# EAGLE schematic ram-8x2K (EAGLE 9.1.3)
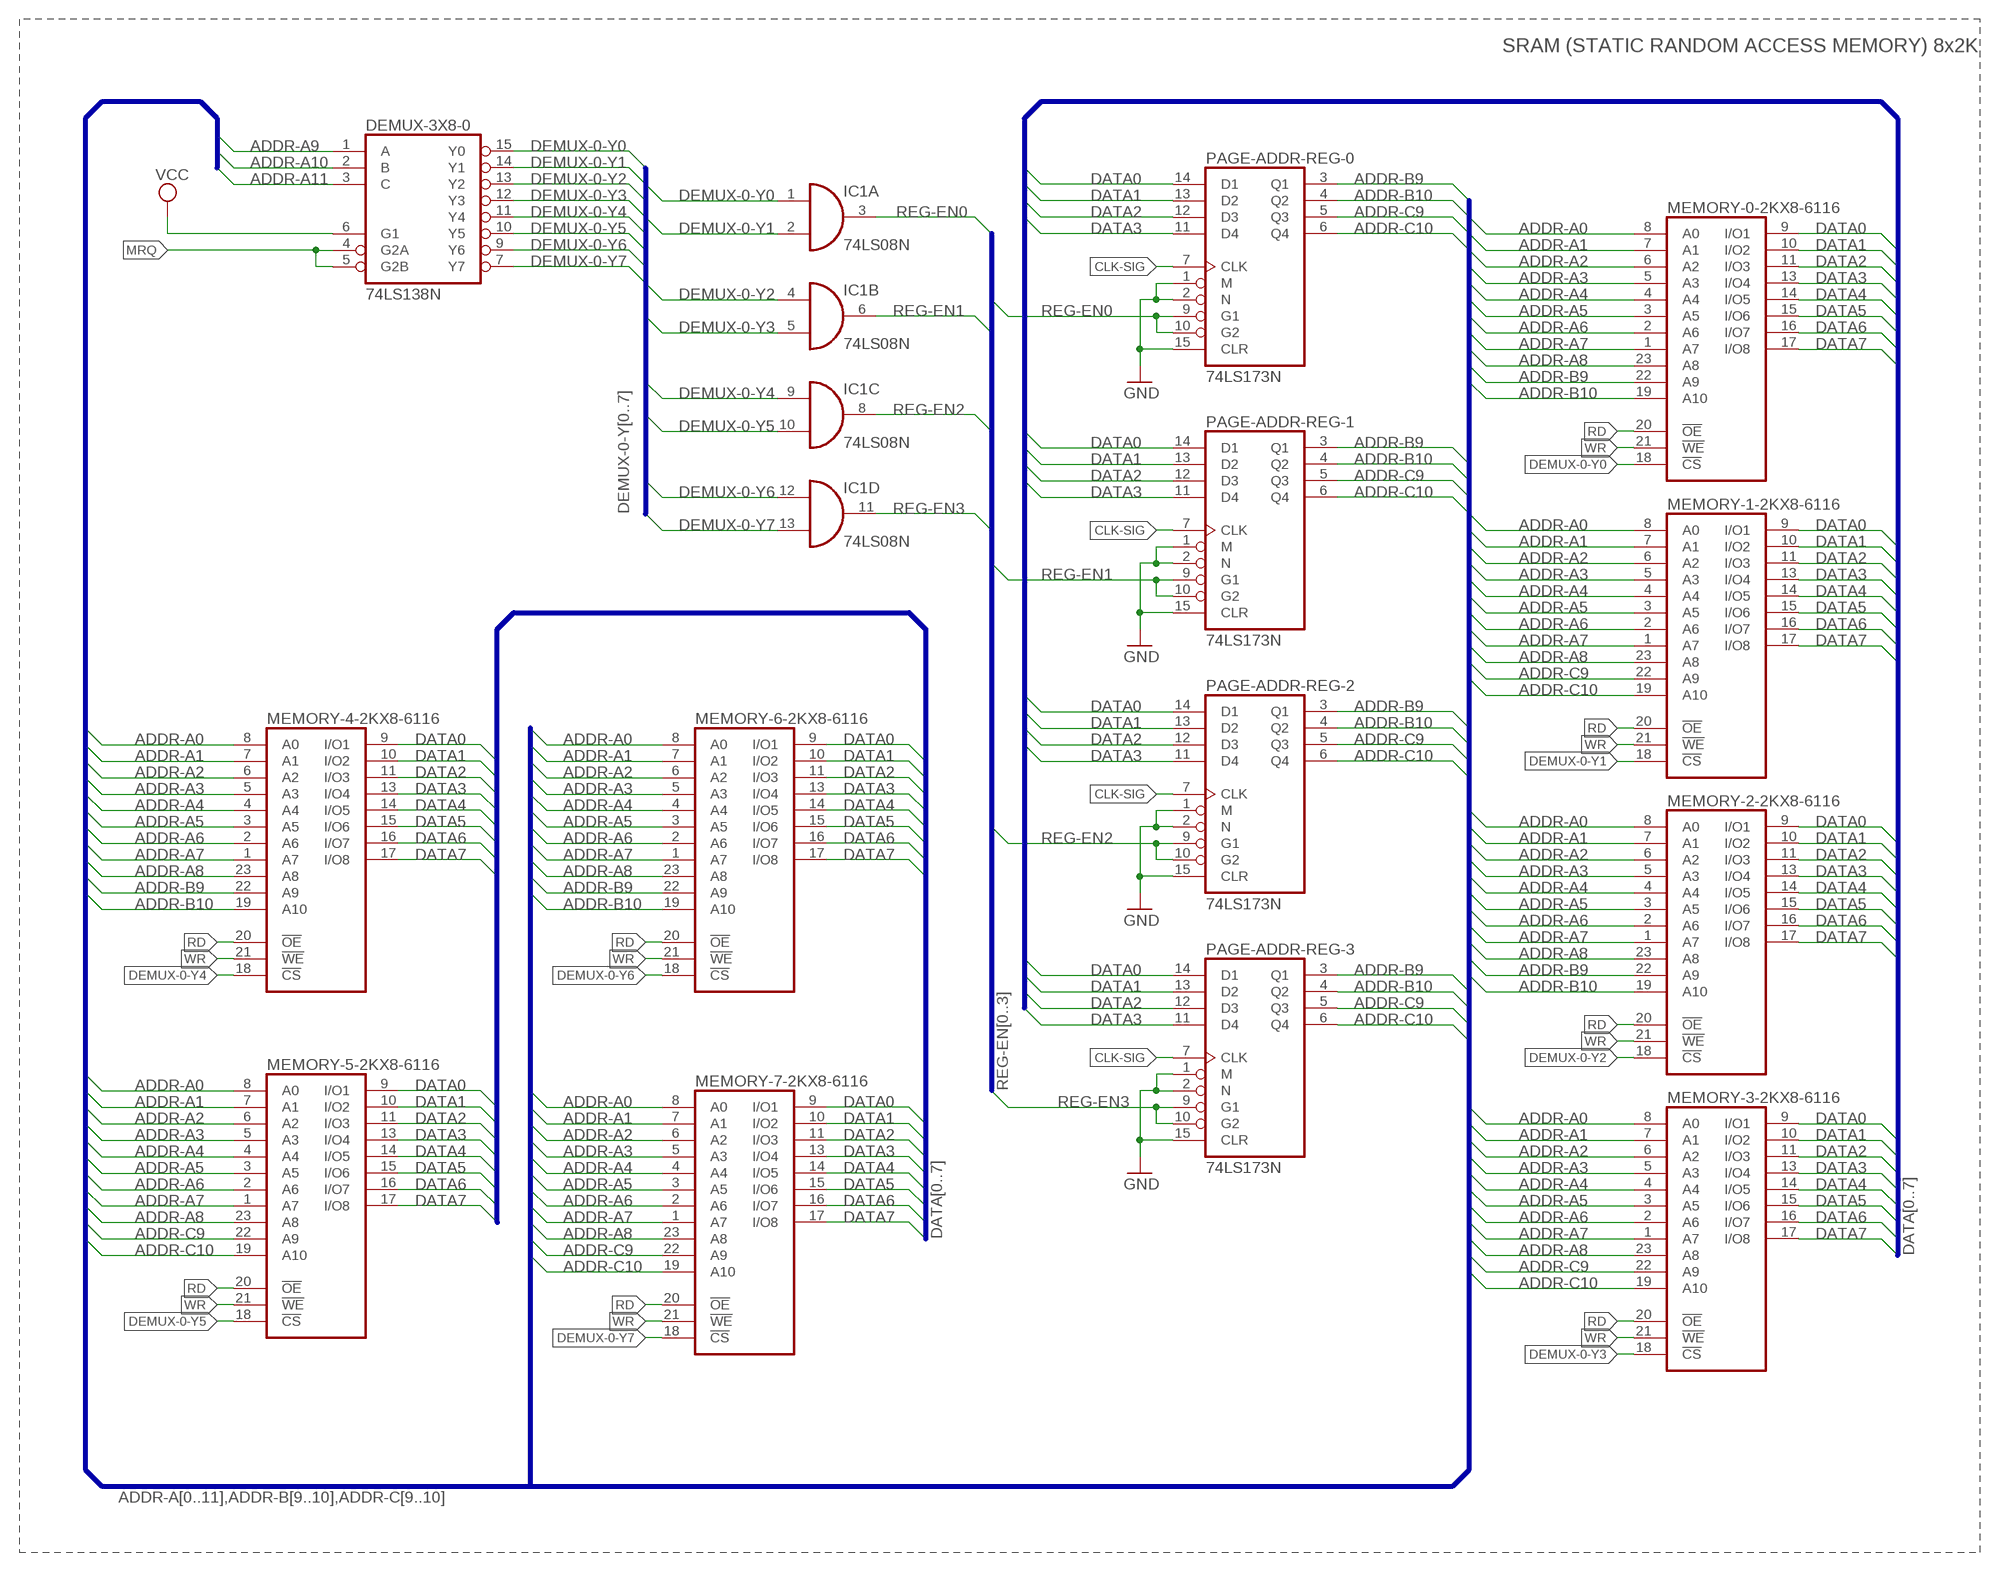
[diagram p0: schematic, sheet 1]

## Parts
DEMUX-3X8-0  74LS138N  [DIL16]
IC1  74LS08N  [DIL14]
MEMORY-0-2KX8-6116  6116P  [DIL24-6]
MEMORY-1-2KX8-6116  6116P  [DIL24-6]
MEMORY-2-2KX8-6116  6116P  [DIL24-6]
MEMORY-3-2KX8-6116  6116P  [DIL24-6]
MEMORY-4-2KX8-6116  6116P  [DIL24-6]
MEMORY-5-2KX8-6116  6116P  [DIL24-6]
MEMORY-6-2KX8-6116  6116P  [DIL24-6]
MEMORY-7-2KX8-6116  6116P  [DIL24-6]
PAGE-ADDR-REG-0  74LS173N  [DIL16]
PAGE-ADDR-REG-1  74LS173N  [DIL16]
PAGE-ADDR-REG-2  74LS173N  [DIL16]
PAGE-ADDR-REG-3  74LS173N  [DIL16]

## Nets
ADDR-A0: MEMORY-0-2KX8-6116.8(A0) MEMORY-1-2KX8-6116.8(A0) MEMORY-2-2KX8-6116.8(A0) MEMORY-3-2KX8-6116.8(A0) MEMORY-4-2KX8-6116.8(A0) MEMORY-5-2KX8-6116.8(A0) MEMORY-6-2KX8-6116.8(A0) MEMORY-7-2KX8-6116.8(A0)
ADDR-A1: MEMORY-0-2KX8-6116.7(A1) MEMORY-1-2KX8-6116.7(A1) MEMORY-2-2KX8-6116.7(A1) MEMORY-3-2KX8-6116.7(A1) MEMORY-4-2KX8-6116.7(A1) MEMORY-5-2KX8-6116.7(A1) MEMORY-6-2KX8-6116.7(A1) MEMORY-7-2KX8-6116.7(A1)
ADDR-A2: MEMORY-0-2KX8-6116.6(A2) MEMORY-1-2KX8-6116.6(A2) MEMORY-2-2KX8-6116.6(A2) MEMORY-3-2KX8-6116.6(A2) MEMORY-4-2KX8-6116.6(A2) MEMORY-5-2KX8-6116.6(A2) MEMORY-6-2KX8-6116.6(A2) MEMORY-7-2KX8-6116.6(A2)
ADDR-A3: MEMORY-0-2KX8-6116.5(A3) MEMORY-1-2KX8-6116.5(A3) MEMORY-2-2KX8-6116.5(A3) MEMORY-3-2KX8-6116.5(A3) MEMORY-4-2KX8-6116.5(A3) MEMORY-5-2KX8-6116.5(A3) MEMORY-6-2KX8-6116.5(A3) MEMORY-7-2KX8-6116.5(A3)
ADDR-A4: MEMORY-0-2KX8-6116.4(A4) MEMORY-1-2KX8-6116.4(A4) MEMORY-2-2KX8-6116.4(A4) MEMORY-3-2KX8-6116.4(A4) MEMORY-4-2KX8-6116.4(A4) MEMORY-5-2KX8-6116.4(A4) MEMORY-6-2KX8-6116.4(A4) MEMORY-7-2KX8-6116.4(A4)
ADDR-A5: MEMORY-0-2KX8-6116.3(A5) MEMORY-1-2KX8-6116.3(A5) MEMORY-2-2KX8-6116.3(A5) MEMORY-3-2KX8-6116.3(A5) MEMORY-4-2KX8-6116.3(A5) MEMORY-5-2KX8-6116.3(A5) MEMORY-6-2KX8-6116.3(A5) MEMORY-7-2KX8-6116.3(A5)
ADDR-A6: MEMORY-0-2KX8-6116.2(A6) MEMORY-1-2KX8-6116.2(A6) MEMORY-2-2KX8-6116.2(A6) MEMORY-3-2KX8-6116.2(A6) MEMORY-4-2KX8-6116.2(A6) MEMORY-5-2KX8-6116.2(A6) MEMORY-6-2KX8-6116.2(A6) MEMORY-7-2KX8-6116.2(A6)
ADDR-A7: MEMORY-0-2KX8-6116.1(A7) MEMORY-1-2KX8-6116.1(A7) MEMORY-2-2KX8-6116.1(A7) MEMORY-3-2KX8-6116.1(A7) MEMORY-4-2KX8-6116.1(A7) MEMORY-5-2KX8-6116.1(A7) MEMORY-6-2KX8-6116.1(A7) MEMORY-7-2KX8-6116.1(A7)
ADDR-A8: MEMORY-0-2KX8-6116.23(A8) MEMORY-1-2KX8-6116.23(A8) MEMORY-2-2KX8-6116.23(A8) MEMORY-3-2KX8-6116.23(A8) MEMORY-4-2KX8-6116.23(A8) MEMORY-5-2KX8-6116.23(A8) MEMORY-6-2KX8-6116.23(A8) MEMORY-7-2KX8-6116.23(A8)
ADDR-A9: DEMUX-3X8-0.1(A)
ADDR-A10: DEMUX-3X8-0.2(B)
ADDR-A11: DEMUX-3X8-0.3(C)
ADDR-B9: MEMORY-0-2KX8-6116.22(A9) MEMORY-2-2KX8-6116.22(A9) MEMORY-4-2KX8-6116.22(A9) MEMORY-6-2KX8-6116.22(A9) PAGE-ADDR-REG-0.3(Q1) PAGE-ADDR-REG-1.3(Q1) PAGE-ADDR-REG-2.3(Q1) PAGE-ADDR-REG-3.3(Q1)
ADDR-B10: MEMORY-0-2KX8-6116.19(A10) MEMORY-2-2KX8-6116.19(A10) MEMORY-4-2KX8-6116.19(A10) MEMORY-6-2KX8-6116.19(A10) PAGE-ADDR-REG-0.4(Q2) PAGE-ADDR-REG-1.4(Q2) PAGE-ADDR-REG-2.4(Q2) PAGE-ADDR-REG-3.4(Q2)
ADDR-C9: MEMORY-1-2KX8-6116.22(A9) MEMORY-3-2KX8-6116.22(A9) MEMORY-5-2KX8-6116.22(A9) MEMORY-7-2KX8-6116.22(A9) PAGE-ADDR-REG-0.5(Q3) PAGE-ADDR-REG-1.5(Q3) PAGE-ADDR-REG-2.5(Q3) PAGE-ADDR-REG-3.5(Q3)
ADDR-C10: MEMORY-1-2KX8-6116.19(A10) MEMORY-3-2KX8-6116.19(A10) MEMORY-5-2KX8-6116.19(A10) MEMORY-7-2KX8-6116.19(A10) PAGE-ADDR-REG-0.6(Q4) PAGE-ADDR-REG-1.6(Q4) PAGE-ADDR-REG-2.6(Q4) PAGE-ADDR-REG-3.6(Q4)
CLK-SIG: PAGE-ADDR-REG-0.7(CLK) PAGE-ADDR-REG-1.7(CLK) PAGE-ADDR-REG-2.7(CLK) PAGE-ADDR-REG-3.7(CLK)
DATA0: MEMORY-0-2KX8-6116.9(I/O1) MEMORY-1-2KX8-6116.9(I/O1) MEMORY-2-2KX8-6116.9(I/O1) MEMORY-3-2KX8-6116.9(I/O1) MEMORY-4-2KX8-6116.9(I/O1) MEMORY-5-2KX8-6116.9(I/O1) MEMORY-6-2KX8-6116.9(I/O1) MEMORY-7-2KX8-6116.9(I/O1) PAGE-ADDR-REG-0.14(D1) PAGE-ADDR-REG-1.14(D1) PAGE-ADDR-REG-2.14(D1) PAGE-ADDR-REG-3.14(D1)
DATA1: MEMORY-0-2KX8-6116.10(I/O2) MEMORY-1-2KX8-6116.10(I/O2) MEMORY-2-2KX8-6116.10(I/O2) MEMORY-3-2KX8-6116.10(I/O2) MEMORY-4-2KX8-6116.10(I/O2) MEMORY-5-2KX8-6116.10(I/O2) MEMORY-6-2KX8-6116.10(I/O2) MEMORY-7-2KX8-6116.10(I/O2) PAGE-ADDR-REG-0.13(D2) PAGE-ADDR-REG-1.13(D2) PAGE-ADDR-REG-2.13(D2) PAGE-ADDR-REG-3.13(D2)
DATA2: MEMORY-0-2KX8-6116.11(I/O3) MEMORY-1-2KX8-6116.11(I/O3) MEMORY-2-2KX8-6116.11(I/O3) MEMORY-3-2KX8-6116.11(I/O3) MEMORY-4-2KX8-6116.11(I/O3) MEMORY-5-2KX8-6116.11(I/O3) MEMORY-6-2KX8-6116.11(I/O3) MEMORY-7-2KX8-6116.11(I/O3) PAGE-ADDR-REG-0.12(D3) PAGE-ADDR-REG-1.12(D3) PAGE-ADDR-REG-2.12(D3) PAGE-ADDR-REG-3.12(D3)
DATA3: MEMORY-0-2KX8-6116.13(I/O4) MEMORY-1-2KX8-6116.13(I/O4) MEMORY-2-2KX8-6116.13(I/O4) MEMORY-3-2KX8-6116.13(I/O4) MEMORY-4-2KX8-6116.13(I/O4) MEMORY-5-2KX8-6116.13(I/O4) MEMORY-6-2KX8-6116.13(I/O4) MEMORY-7-2KX8-6116.13(I/O4) PAGE-ADDR-REG-0.11(D4) PAGE-ADDR-REG-1.11(D4) PAGE-ADDR-REG-2.11(D4) PAGE-ADDR-REG-3.11(D4)
DATA4: MEMORY-0-2KX8-6116.14(I/O5) MEMORY-1-2KX8-6116.14(I/O5) MEMORY-2-2KX8-6116.14(I/O5) MEMORY-3-2KX8-6116.14(I/O5) MEMORY-4-2KX8-6116.14(I/O5) MEMORY-5-2KX8-6116.14(I/O5) MEMORY-6-2KX8-6116.14(I/O5) MEMORY-7-2KX8-6116.14(I/O5)
DATA5: MEMORY-0-2KX8-6116.15(I/O6) MEMORY-1-2KX8-6116.15(I/O6) MEMORY-2-2KX8-6116.15(I/O6) MEMORY-3-2KX8-6116.15(I/O6) MEMORY-4-2KX8-6116.15(I/O6) MEMORY-5-2KX8-6116.15(I/O6) MEMORY-6-2KX8-6116.15(I/O6) MEMORY-7-2KX8-6116.15(I/O6)
DATA6: MEMORY-0-2KX8-6116.16(I/O7) MEMORY-1-2KX8-6116.16(I/O7) MEMORY-2-2KX8-6116.16(I/O7) MEMORY-3-2KX8-6116.16(I/O7) MEMORY-4-2KX8-6116.16(I/O7) MEMORY-5-2KX8-6116.16(I/O7) MEMORY-6-2KX8-6116.16(I/O7) MEMORY-7-2KX8-6116.16(I/O7)
DATA7: MEMORY-0-2KX8-6116.17(I/O8) MEMORY-1-2KX8-6116.17(I/O8) MEMORY-2-2KX8-6116.17(I/O8) MEMORY-3-2KX8-6116.17(I/O8) MEMORY-4-2KX8-6116.17(I/O8) MEMORY-5-2KX8-6116.17(I/O8) MEMORY-6-2KX8-6116.17(I/O8) MEMORY-7-2KX8-6116.17(I/O8)
DEMUX-0-Y0: DEMUX-3X8-0.15(Y0) IC1.1(A:I0) MEMORY-0-2KX8-6116.18(!CS)
DEMUX-0-Y1: DEMUX-3X8-0.14(Y1) IC1.2(A:I1) MEMORY-1-2KX8-6116.18(!CS)
DEMUX-0-Y2: DEMUX-3X8-0.13(Y2) IC1.4(B:I0) MEMORY-2-2KX8-6116.18(!CS)
DEMUX-0-Y3: DEMUX-3X8-0.12(Y3) IC1.5(B:I1) MEMORY-3-2KX8-6116.18(!CS)
DEMUX-0-Y4: DEMUX-3X8-0.11(Y4) IC1.9(C:I0) MEMORY-4-2KX8-6116.18(!CS)
DEMUX-0-Y5: DEMUX-3X8-0.10(Y5) IC1.10(C:I1) MEMORY-5-2KX8-6116.18(!CS)
DEMUX-0-Y6: DEMUX-3X8-0.9(Y6) IC1.12(D:I0) MEMORY-6-2KX8-6116.18(!CS)
DEMUX-0-Y7: DEMUX-3X8-0.7(Y7) IC1.13(D:I1) MEMORY-7-2KX8-6116.18(!CS)
GND: PAGE-ADDR-REG-0.1(M) PAGE-ADDR-REG-0.2(N) PAGE-ADDR-REG-0.15(CLR) PAGE-ADDR-REG-1.1(M) PAGE-ADDR-REG-1.2(N) PAGE-ADDR-REG-1.15(CLR) PAGE-ADDR-REG-2.1(M) PAGE-ADDR-REG-2.2(N) PAGE-ADDR-REG-2.15(CLR) PAGE-ADDR-REG-3.1(M) PAGE-ADDR-REG-3.2(N) PAGE-ADDR-REG-3.15(CLR)
MRQ: DEMUX-3X8-0.4(G2A) DEMUX-3X8-0.5(G2B)
RD: MEMORY-0-2KX8-6116.20(!OE) MEMORY-1-2KX8-6116.20(!OE) MEMORY-2-2KX8-6116.20(!OE) MEMORY-3-2KX8-6116.20(!OE) MEMORY-4-2KX8-6116.20(!OE) MEMORY-5-2KX8-6116.20(!OE) MEMORY-6-2KX8-6116.20(!OE) MEMORY-7-2KX8-6116.20(!OE)
REG-EN0: IC1.3(A:O) PAGE-ADDR-REG-0.9(G1) PAGE-ADDR-REG-0.10(G2)
REG-EN1: IC1.6(B:O) PAGE-ADDR-REG-1.9(G1) PAGE-ADDR-REG-1.10(G2)
REG-EN2: IC1.8(C:O) PAGE-ADDR-REG-2.9(G1) PAGE-ADDR-REG-2.10(G2)
REG-EN3: IC1.11(D:O) PAGE-ADDR-REG-3.9(G1) PAGE-ADDR-REG-3.10(G2)
VCC: DEMUX-3X8-0.6(G1)
WR: MEMORY-0-2KX8-6116.21(!WE) MEMORY-1-2KX8-6116.21(!WE) MEMORY-2-2KX8-6116.21(!WE) MEMORY-3-2KX8-6116.21(!WE) MEMORY-4-2KX8-6116.21(!WE) MEMORY-5-2KX8-6116.21(!WE) MEMORY-6-2KX8-6116.21(!WE) MEMORY-7-2KX8-6116.21(!WE)

## Buses
REG-EN[0..3]
DEMUX-0-Y[0..7]
ADDR-A[0..11],ADDR-B[9..10],ADDR-C[9..10]
DATA[0..7]

## Notes on the sheet
- SRAM (STATIC RANDOM ACCESS MEMORY) 8x2K

## Power pins joined to a net without a drawn wire
GND: DEMUX-3X8-0.8(GND) IC1.7(P:GND) MEMORY-0-2KX8-6116.12(GND) MEMORY-1-2KX8-6116.12(GND) MEMORY-2-2KX8-6116.12(GND) MEMORY-3-2KX8-6116.12(GND) MEMORY-4-2KX8-6116.12(GND) MEMORY-5-2KX8-6116.12(GND) MEMORY-6-2KX8-6116.12(GND) MEMORY-7-2KX8-6116.12(GND) PAGE-ADDR-REG-0.8(GND) PAGE-ADDR-REG-1.8(GND) PAGE-ADDR-REG-2.8(GND) PAGE-ADDR-REG-3.8(GND)
VCC: DEMUX-3X8-0.16(VCC) IC1.14(P:VCC) MEMORY-0-2KX8-6116.24(VCC) MEMORY-1-2KX8-6116.24(VCC) MEMORY-2-2KX8-6116.24(VCC) MEMORY-3-2KX8-6116.24(VCC) MEMORY-4-2KX8-6116.24(VCC) MEMORY-5-2KX8-6116.24(VCC) MEMORY-6-2KX8-6116.24(VCC) MEMORY-7-2KX8-6116.24(VCC) PAGE-ADDR-REG-0.16(VCC) PAGE-ADDR-REG-1.16(VCC) PAGE-ADDR-REG-2.16(VCC) PAGE-ADDR-REG-3.16(VCC)

## Library data of the parts
DEMUX-3X8-0 = 74xx-eu:74*138: 3-line to 8-line DECODER/DEMULTIPLEXER
IC1 = 74xx-eu:74*08: Quad 2-input AND gate
MEMORY-0-2KX8-6116 MEMORY-1-2KX8-6116 MEMORY-2-2KX8-6116 MEMORY-3-2KX8-6116 MEMORY-4-2KX8-6116 MEMORY-5-2KX8-6116 MEMORY-6-2KX8-6116 MEMORY-7-2KX8-6116 = memory-idt:6116P: MEMORY; OC_FARNELL: unknown; OC_NEWARK: unknown
PAGE-ADDR-REG-0 PAGE-ADDR-REG-1-PAGE-ADDR-REG-3 = 74xx-eu:74*173: 4-bit D type REGISTER, 3-state